# Altium schematic sheet NucciL.SchDoc: NucciL
size A3; ApprovedBy: Storozhenko Roman; CheckedBy: Storozhenko Roman; Author: Storozhenko Roman; CompanyName: D_EL; Organization: Storozhenko Roman; Address1: Ukraine; Address2: Kharkiv; Revision: 0.1; SheetNumber: 1; SheetTotal: 1
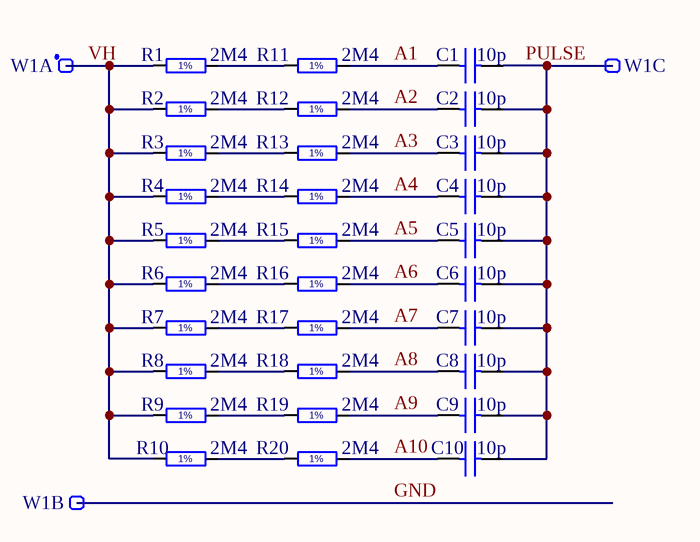
[diagram p0: NucciL.SchDoc]

## Parts
C1  10p  [CAPC3216X70N]
C2  10p  [CAPC3216X70N]
C3  10p  [CAPC3216X70N]
C4  10p  [CAPC3216X70N]
C5  10p  [CAPC3216X70N]
C6  10p  [CAPC3216X70N]
C7  10p  [CAPC3216X70N]
C8  10p  [CAPC3216X70N]
C9  10p  [CAPC3216X70N]
C10  10p  [CAPC3216X70N]
R1  2M4  [RESC3216X65N]
R2  2M4  [RESC3216X65N]
R3  2M4  [RESC3216X65N]
R4  2M4  [RESC3216X65N]
R5  2M4  [RESC3216X65N]
R6  2M4  [RESC3216X65N]
R7  2M4  [RESC3216X65N]
R8  2M4  [RESC3216X65N]
R9  2M4  [RESC3216X65N]
R10  2M4  [RESC3216X65N]
R11  2M4  [RESC3216X65N]
R12  2M4  [RESC3216X65N]
R13  2M4  [RESC3216X65N]
R14  2M4  [RESC3216X65N]
R15  2M4  [RESC3216X65N]
R16  2M4  [RESC3216X65N]
R17  2M4  [RESC3216X65N]
R18  2M4  [RESC3216X65N]
R19  2M4  [RESC3216X65N]
R20  2M4  [RESC3216X65N]
W1  Test Point  [COMATEL_385.0358.1.03.400]  (value not drawn)  (parts A,B,C of 3)

## Nets
A1: C1.1 R11.2
A2: C2.1 R12.2
A3: C3.1 R13.2
A4: C4.1 R14.2
A5: C5.1 R15.2
A6: C6.1 R16.2
A7: C7.1 R17.2
A8: C8.1 R18.2
A9: C9.1 R19.2
A10: C10.1 R20.2
GND: W1.2
PULSE: C1.2 C2.2 C3.2 C4.2 C5.2 C6.2 C7.2 C8.2 C9.2 C10.2 W1.3
VH: R1.1 R2.1 R3.1 R4.1 R5.1 R6.1 R7.1 R8.1 R9.1 R10.1 W1.1
NetR1_2: R1.2 R11.1
NetR2_2: R2.2 R12.1
NetR3_2: R3.2 R13.1
NetR4_2: R4.2 R14.1
NetR5_2: R5.2 R15.1
NetR6_2: R6.2 R16.1
NetR7_2: R7.2 R17.1
NetR8_2: R8.2 R18.1
NetR9_2: R9.2 R19.1
NetR10_2: R10.2 R20.1

## Notes on the sheet
- Title
- Size:
- Date:
- A3
- Time:
- Revision:
- Sheet
- of
- File:
- (in symbol R1206_2M4_1%_0.25W_100PPM) 1%

## Library data of the parts
C1-C10 = CC1206_10PF_500V_5%_NP0: Non-polarised capacitor; Part Description: SMD Multilayer Chip Ceramic Capacitor; Manufacturer: GENERIC; Manufacturer1 Part Number: CC1206JRNPOBBN100; Voltage: 500V; TC: NP0; Tolerance: ±5%; Part Number: CC1206_10PF_500V_5%_NP0; Component Kind: Standard; Component Type: Standard; Pin Count: 2; Value: 10p; Status: None; Manufacturer Part Number: CC1206_10PF_500V_5%_NP0; Case: 1206; Mounted: Yes; Socket: No; SMD: Yes; Manufacturer1 Example: YAGEO; Manufacturer1 ComponentHeight: 0.7mm; HelpURL: \\cern.ch\dfs\Applications\Altium\Datasheets\CC1206_YAGEO_MID-VOLTAGE.pdf; Author: CERN DEM JLC; CreateDate: 10/25/2011; LatestRevisionDate: 10/25/2011
R1-R20 = R1206_2M4_1%_0.25W_100PPM: Resistor - 1%; Part Description: General Purpose Thick Film Chip Resistor; Manufacturer: GENERIC; Manufacturer1 Part Number: CRCW12062M40FKEA; Power: 0.25W; TC: ±100ppm/°C; Part Number: R1206_2M4_1%_0.25W_100PPM; Component Kind: Standard; Component Type: Standard; Pin Count: 2; Value: 2M4; Status: Preferred; Tolerance: ±1%; Manufacturer Part Number: R1206_2M4_1%_0.25W_100PPM; Case: 1206; Mounted: Yes; Socket: No; SMD: Yes; Manufacturer1 Example: Vishay; Manufacturer1 ComponentHeight: 0.55mm; Author: DEL; CreateDate: 6/3/2025; LatestRevisionDate: 6/3/2025
W1 = COMATEL_385.0358.1.03.400: 3 Mini Wire-Wrap Contact Strip Header; Part Description: 3 Contacts Straight Strip Header Pitch 2.54mm L=6.3mm ''Mini-Wire-Wrap''; Manufacturer: KONTEK COMATEL; Part Number: COMATEL_385.0358.1.03.400; Component Kind: Standard; Component Type: Standard; Pin Count: 3; Family: Test Point; Mounted: Yes; Socket: No; SMD: No; Status: None; Manufacturer Part Number: 385.0358.1.03.400; ComponentHeight: 8mm; HelpURL: \\cern.ch\dfs\Applications\Altium\Datasheets\COMATEL_385.0358.1.03.400.pdf; Author: CERN DEM JLC; CreateDate: 6/30/2010; LatestRevisionDate: 6/30/2010